# EAGLE design Hat_CoVASPSy_v1re2 (EAGLE 9.6.2)
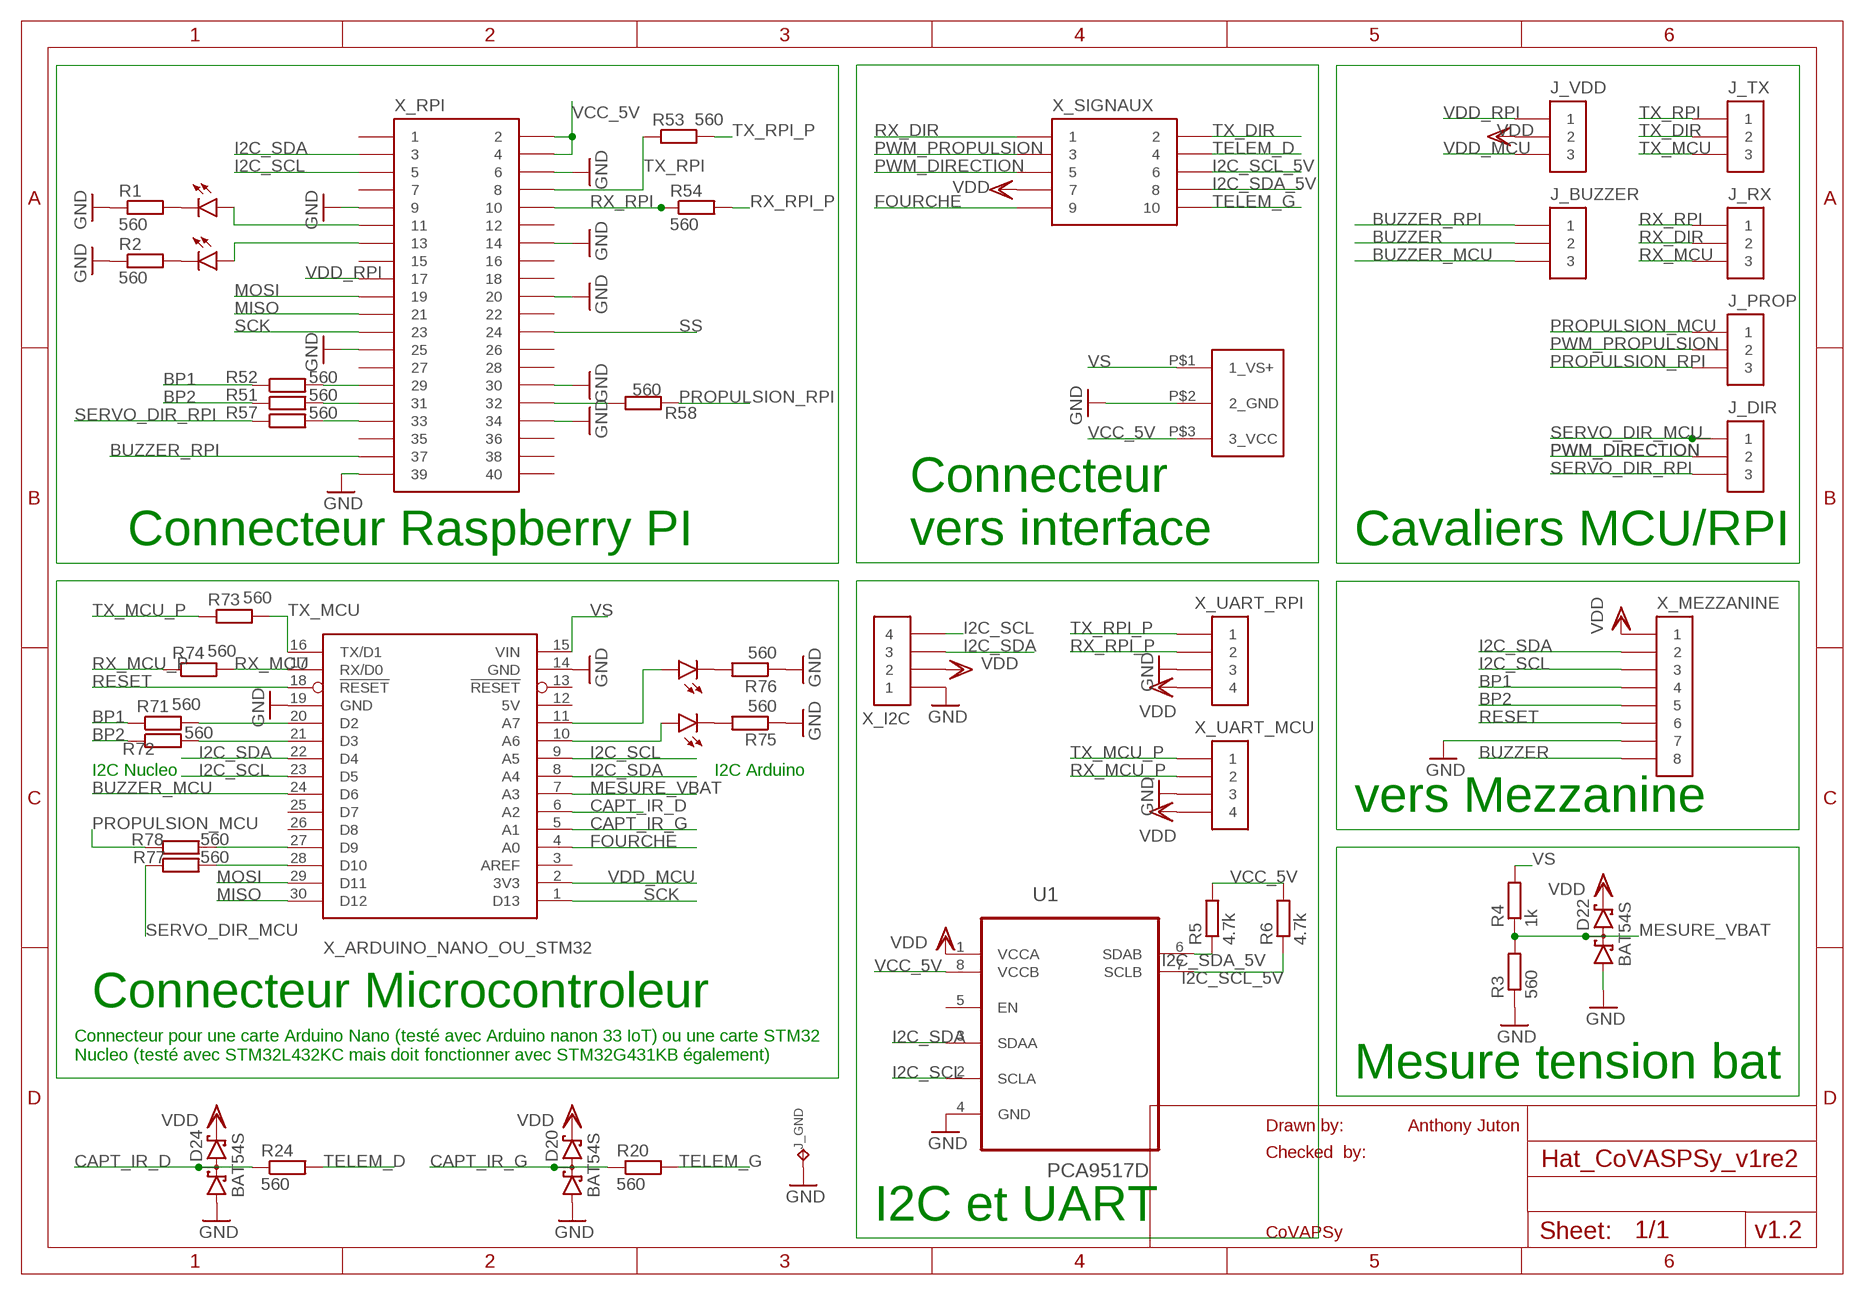
[diagram p0: schematic, sheet 1]

## Parts
D20  BAT54S  [SOT23]
D22  BAT54S  [SOT23]
D24  BAT54S  [SOT23]
J_BUZZER  CAVALIER_3  [CAVALIER_3]
J_DIR  CAVALIER_3  [CAVALIER_3]
J_GND  COSSE_POIGN  [COSSE_POIGNARD]
J_PROP  CAVALIER_3  [CAVALIER_3]
J_RX  CAVALIER_3  [CAVALIER_3]
J_TX  CAVALIER_3  [CAVALIER_3]
J_VDD  CAVALIER_3  [CAVALIER_3]
LED1  LEDSML1206  [SML1206]
LED2  LEDSML1206  [SML1206]
LED3  LEDSML1206  [SML1206]
LED4  LEDSML1206  [SML1206]
R1  560  R-EU_M1206  [M1206]
R2  560  R-EU_M1206  [M1206]
R3  560  R-EU_M1206  [M1206]
R4  1k  R-EU_M1206  [M1206]
R5  4.7k  R-EU_M1206  [M1206]
R6  4.7k  R-EU_M1206  [M1206]
R20  560  R-EU_M1206  [M1206]
R24  560  R-EU_M1206  [M1206]
R51  560  R-EU_M1206  [M1206]
R52  560  R-EU_M1206  [M1206]
R53  560  R-EU_M1206  [M1206]
R54  560  R-EU_M1206  [M1206]
R57  560  R-EU_M1206  [M1206]
R58  560  R-EU_M1206  [M1206]
R71  560  R-EU_M1206  [M1206]
R72  560  R-EU_M1206  [M1206]
R73  560  R-EU_M1206  [M1206]
R74  560  R-EU_M1206  [M1206]
R75  560  R-EU_M1206  [M1206]
R76  560  R-EU_M1206  [M1206]
R77  560  R-EU_M1206  [M1206]
R78  560  R-EU_M1206  [M1206]
U1  PCA9517D  [SOIC127P600X175-8N]
X_ALIM  CONN_ALIM_3TROUS  [CONN_ALIM_3TROUS]
X_ARDUINO_NANO_OU_STM32  ARDUINO_NANO_STM32_NUCLEO  [ARDUINO_NANO_STM32_NUCLEO]
X_I2C  MOLEX_4_DROIT  [MOLEX_4_DROIT]
X_MEZZANINE  MOLEX_8_DROIT  [MOLEX_8_DROIT]
X_RPI  HEADER_20X2  [HEADER_20X2]
X_SIGNAUX  HEADER_5X2  [HEADER_5X2]
X_UART_MCU  MOLEX_4_DROIT  [MOLEX_4_DROIT]
X_UART_RPI  MOLEX_4_DROIT  [MOLEX_4_DROIT]

## Nets
BP1: R52.1 R71.1 X_MEZZANINE.P$4
BP2: R51.1 R72.1 X_MEZZANINE.P$5
BUZZER: J_BUZZER.P$2 X_MEZZANINE.P$8
BUZZER_MCU: J_BUZZER.P$3 X_ARDUINO_NANO_OU_STM32.24(D6)
BUZZER_RPI: J_BUZZER.P$1 X_RPI.P$37
CAPT_IR_D: D24.3(C1A2) R24.1 X_ARDUINO_NANO_OU_STM32.6(A2)
CAPT_IR_G: D20.3(C1A2) R20.1 X_ARDUINO_NANO_OU_STM32.5(A1)
FOURCHE: X_ARDUINO_NANO_OU_STM32.4(A0) X_SIGNAUX.P$9
GND: D20.1(A1) D22.1(A1) D24.1(A1) J_GND.P$1 R1.1 R2.1 R3.1 R75.1 R76.1 U1.4(GND) X_ALIM.P$2(2_GND) X_ARDUINO_NANO_OU_STM32.14(GND) X_ARDUINO_NANO_OU_STM32.19(GND) X_I2C.P$1 X_MEZZANINE.P$7 X_RPI.P$6 X_RPI.P$9 X_RPI.P$14 X_RPI.P$20 X_RPI.P$25 X_RPI.P$30 X_RPI.P$34 X_RPI.P$39 X_UART_MCU.P$3 X_UART_RPI.P$3
I2C_SCL: U1.2(SCLA) X_ARDUINO_NANO_OU_STM32.9(A5) X_ARDUINO_NANO_OU_STM32.23(D5) X_I2C.P$4 X_MEZZANINE.P$3 X_RPI.P$5
I2C_SCL_5V: R6.1 U1.7(SCLB) X_SIGNAUX.P$6
I2C_SDA: U1.3(SDAA) X_ARDUINO_NANO_OU_STM32.8(A4) X_ARDUINO_NANO_OU_STM32.22(D4) X_I2C.P$3 X_MEZZANINE.P$2 X_RPI.P$3
I2C_SDA_5V: R5.1 U1.6(SDAB) X_SIGNAUX.P$8
MESURE_VBAT: D22.3(C1A2) R3.2 R4.1 X_ARDUINO_NANO_OU_STM32.7(A3)
MISO: X_ARDUINO_NANO_OU_STM32.30(D12) X_RPI.P$21
MOSI: X_ARDUINO_NANO_OU_STM32.29(D11) X_RPI.P$19
N$1: LED1.C R1.2
N$2: LED3.A X_ARDUINO_NANO_OU_STM32.11(A7)
N$3: R71.2 X_ARDUINO_NANO_OU_STM32.20(D2)
N$4: R72.2 X_ARDUINO_NANO_OU_STM32.21(D3)
N$5: LED2.C R2.2
N$6: LED1.A X_RPI.P$11
N$7: R52.2 X_RPI.P$29
N$9: R77.2 X_ARDUINO_NANO_OU_STM32.28(D10)
N$10: R51.2 X_RPI.P$31
N$15: LED3.C R76.2
N$17: LED2.A X_RPI.P$13
N$19: R57.2 X_RPI.P$33
N$20: R58.1 X_RPI.P$32
N$21: R78.2 X_ARDUINO_NANO_OU_STM32.27(D9)
N$22: LED4.A X_ARDUINO_NANO_OU_STM32.10(A6)
N$47: LED4.C R75.2
PROPULSION_MCU: J_PROP.P$1 R78.1
PROPULSION_RPI: J_PROP.P$3 R58.2
PWM_DIRECTION: J_DIR.P$2 X_SIGNAUX.P$5
PWM_PROPULSION: J_PROP.P$2 X_SIGNAUX.P$3
RESET: X_ARDUINO_NANO_OU_STM32.18(!RESET) X_MEZZANINE.P$6
RX_DIR: J_RX.P$2 X_SIGNAUX.P$1
RX_MCU: J_RX.P$3 R74.2 X_ARDUINO_NANO_OU_STM32.17(RX/D0)
RX_MCU_P: R74.1 X_UART_MCU.P$2
RX_RPI: J_RX.P$1 R54.1 X_RPI.P$10
RX_RPI_P: R54.2 X_UART_RPI.P$2
SCK: X_ARDUINO_NANO_OU_STM32.1(D13) X_RPI.P$23
SERVO_DIR_MCU: J_DIR.P$1 R77.1
SERVO_DIR_RPI: J_DIR.P$3 R57.1
SS: X_RPI.P$24
TELEM_D: R24.2 X_SIGNAUX.P$4
TELEM_G: R20.2 X_SIGNAUX.P$10
TX_DIR: J_TX.P$2 X_SIGNAUX.P$2
TX_MCU: J_TX.P$3 R73.2 X_ARDUINO_NANO_OU_STM32.16(TX/D1)
TX_MCU_P: R73.1 X_UART_MCU.P$1
TX_RPI: J_TX.P$1 R53.1 X_RPI.P$8
TX_RPI_P: R53.2 X_UART_RPI.P$1
VCC_5V: R5.2 R6.2 U1.8(VCCB) X_ALIM.P$3(3_VCC) X_RPI.P$2 X_RPI.P$4
VDD: D20.2(C2) D22.2(C2) D24.2(C2) J_VDD.P$2 U1.1(VCCA) X_I2C.P$2 X_MEZZANINE.P$1 X_SIGNAUX.P$7 X_UART_MCU.P$4 X_UART_RPI.P$4
VDD_MCU: J_VDD.P$3 X_ARDUINO_NANO_OU_STM32.2(3V3)
VDD_RPI: J_VDD.P$1 X_RPI.P$17
VS: R4.2 X_ALIM.P$1(1_VS+) X_ARDUINO_NANO_OU_STM32.15(VIN)
Unconnected: U1.5(EN) X_ARDUINO_NANO_OU_STM32.3(AREF) X_ARDUINO_NANO_OU_STM32.13(!RESET) X_ARDUINO_NANO_OU_STM32.25(D7) X_ARDUINO_NANO_OU_STM32.26(D8) X_RPI.P$1 X_RPI.P$7 X_RPI.P$12 X_RPI.P$15 X_RPI.P$16 X_RPI.P$18 X_RPI.P$22 X_RPI.P$26 X_RPI.P$27 X_RPI.P$28 X_RPI.P$35 X_RPI.P$36 X_RPI.P$38 X_RPI.P$40

## Notes on the sheet
- Connecteur Raspberry PI
- Connecteur
  vers interface
- Cavaliers MCU/RPI
- I2C Nucleo | I2C Arduino
- vers Mezzanine
- Connecteur Microcontroleur
- Connecteur pour une carte Arduino Nano (testé avec Arduino nanon 33 IoT) ou une carte STM32
  Nucleo (testé avec STM32L432KC mais doit fonctionner avec STM32G431KB également)
- Mesure tension bat
- Drawn by: | Anthony Juton
- Checked  by:
- I2C et UART
- CoVAPSy | v1.2

## Power pins joined to a net without a drawn wire
5V: X_ARDUINO_NANO_OU_STM32.12(5V)

## Library data of the parts
D20 D22 D24 = diode:BAT54S: Schottky Diodes Pin connection corrected 2011-05-04 Source: Fairchild .. BAT54.pdf
J_BUZZER J_DIR J_PROP J_RX J_TX J_VDD = lib_ens_aj_v1:CAVALIER_3
J_GND = lib_ens_aj_v1:COSSE_POIGN
LED1-LED4 = led:LED: LED OSRAM: - CHIPLED LG R971, LG N971, LY N971, LG Q971, LY Q971, LO R971, LY R971 LH N974, LH R974 LS Q976, LO Q976, LY Q976 LO Q996 - Hyper CHIPLED LW Q18S LB Q993, LB Q99A, LB R99A - SideLED LS A670, LO A670, LY A670, LG A670, LP A670 LB A673, LV A673, LT A673, LW A673 LH A674 LY A675 LS A676, LA A676, LO A676, LY A676, LW A676 LS A679, LY A679, LG A679 - Hyper Micro SIDELED® LS Y876, LA Y876, LO Y876, LY Y876 LT Y87S - SmartLED LW L88C, LW L88S LB L89C, LB L89S, LG L890 LS L89K, LO L89K, LY L89K LS L896, LA L896, LO L896, LY L896 - TOPLED LS T670, LO T670, LY T670, LG T670, LP T670 LSG T670, LSP T670, LSY T670, LOP T670, LYG T670 LG T671, LOG T671, LSG T671 LB T673, LV T673, LT T673, LW T673 LH T674 LS T676, LA T676, LO T676, LY T676, LB T676, LH T676, LSB T676, LW T676 LB T67C, LV T67C, LT T67C, LS T67K, LO T67K, LY T67K, LW E67C LS E67B, LA E67B, LO E67B, LY E67B, LB E67C, LV E67C, LT E67C LW T67C LS T679, LY T679, LG T679 LS T770, LO T770, LY T770, LG T770, LP T770 LB T773, LV T773, LT T773, LW T773 LH T774 LS E675, LA E675, LY E675, LS T675 LS T776, LA T776, LO T776, LY T776, LB T776 LHGB T686 LT T68C, LB T68C - Hyper Mini TOPLED® LB M676 - Mini TOPLED Santana® LG M470 LS M47K, LO M47K, LY M47K Source: http://www.osram.convergy.de LUXEON: - LUMILED® LXK2-PW12-R00, LXK2-PW12-S00, LXK2-PW14-U00, LXK2-PW14-V00 LXK2-PM12-R00, LXK2-PM12-S00, LXK2-PM14-U00 LXK2-PE12-Q00, LXK2-PE12-R00, LXK2-PE12-S00, LXK2-PE14-T00, LXK2-PE14-U00 LXK2-PB12-K00, LXK2-PB12-L00, LXK2-PB12-M00, LXK2-PB14-N00, LXK2-PB14-P00, LXK2-PB14-Q00 LXK2-PR12-L00, LXK2-PR12-M00, LXK2-PR14-Q00, LXK2-PR14-R00 LXK2-PD12-Q00, LXK2-PD12-R00, LXK2-PD12-S00 LXK2-PH12-R00, LXK2-PH12-S00 LXK2-PL12-P00, LXK2-PL12-Q00, LXK2-PL12-R00 Source: www.luxeon.com KINGBRIGHT: KA-3528ASYC Source: www.kingbright.com
R1-R6 R20 R24 R51-R54 R57 R58 R71-R78 = rcl:R-EU_: RESISTOR, European symbol
U1 = Texas Instruments_By_element14_Batch_1:PCA9517D: LEVEL-TRANSLATING I2C BUS REPEATER; MPN: PCA9517D; OC_FARNELL: 1831204; OC_NEWARK: 71M0457; PACKAGE: SOIC-8; SUPPLIER: Texas Instruments
X_ALIM = lib_ens_aj_v1:CONN_ALIM_3TROUS
X_ARDUINO_NANO_OU_STM32 = ArduinoNano_STM32_Nucleo:ARDUINO_NANO_STM32_NUCLEO: Arduino Nano V3.0 Overview: The Arduino Nano is a small, complete, and breadboard-friendly board based on the ATmega328 (Arduino Nano 3.x) or ATmega168 (Arduino Nano 2.x). It has more or less the same functionality of the Arduino Duemilanove, but in a different package. It lacks only a DC power jack, and works with a Mini-B USB cable instead of a standard one. The Nano was designed and is being produced by Gravitech. Specifications: Microcontroller Atmel ATmega168 or ATmega328 Operating Voltage (logic level) 5 V Input Voltage (recommended) 7-12 V Input Voltage (limits) 6-20 V Digital I/O Pins 14 (of which 6 provide PWM output) Analog Input Pins 8 DC Current per I/O Pin 40 mA Flash Memory 16 KB (ATmega168) or 32 KB (ATmega328) of which 2 KB used by bootloader SRAM 1 KB (ATmega168) or 2 KB (ATmega328) EEPROM 512 bytes (ATmega168) or 1 KB (ATmega328) Clock Speed 16 MHz Dimensions 0.73" x 1.70" Length 45 mm Width 18 mm Weigth 5 g Power: The Arduino Nano can be powered via the Mini-B USB connection, 6-20V unregulated external power supply (pin 30), or 5V regulated external power supply (pin 27). The power source is automatically selected to the highest voltage source. Memory: The ATmega168 has 16 KB of flash memory for storing code (of which 2 KB is used for the bootloader); the ATmega328 has 32 KB, (also with 2 KB used for the bootloader). The ATmega168 has 1 KB of SRAM and 512 bytes of EEPROM (which can be read and written with the EEPROM library); the ATmega328 has 2 KB of SRAM and 1 KB of EEPROM. Input and Output: Each of the 14 digital pins on the Nano can be used as an input or output, using pinMode(), digitalWrite(), and digitalRead() functions. They operate at 5 volts. Each pin can provide or receive a maximum of 40 mA and has an internal pull-up resistor (disconnected by default) of 20-50 kOhms. In addition, some pins have specialized functions. Visit Arduino - ArduinoBoardNano <https://www.arduino.cc/en/Main/ArduinoBoardNano>
X_I2C X_UART_MCU X_UART_RPI = lib_ens_aj_v1:MOLEX_4_DROIT
X_MEZZANINE = lib_ens_aj_v1:MOLEX_8_DROIT
X_RPI = lib_ens_aj_v1:HEADER_20X2
X_SIGNAUX = lib_ens_aj_v1:HEADER_5X2

## Net classes
0 default: width 0.4 mm, drill 0.6 mm, clearance 0.3 mm

## Board
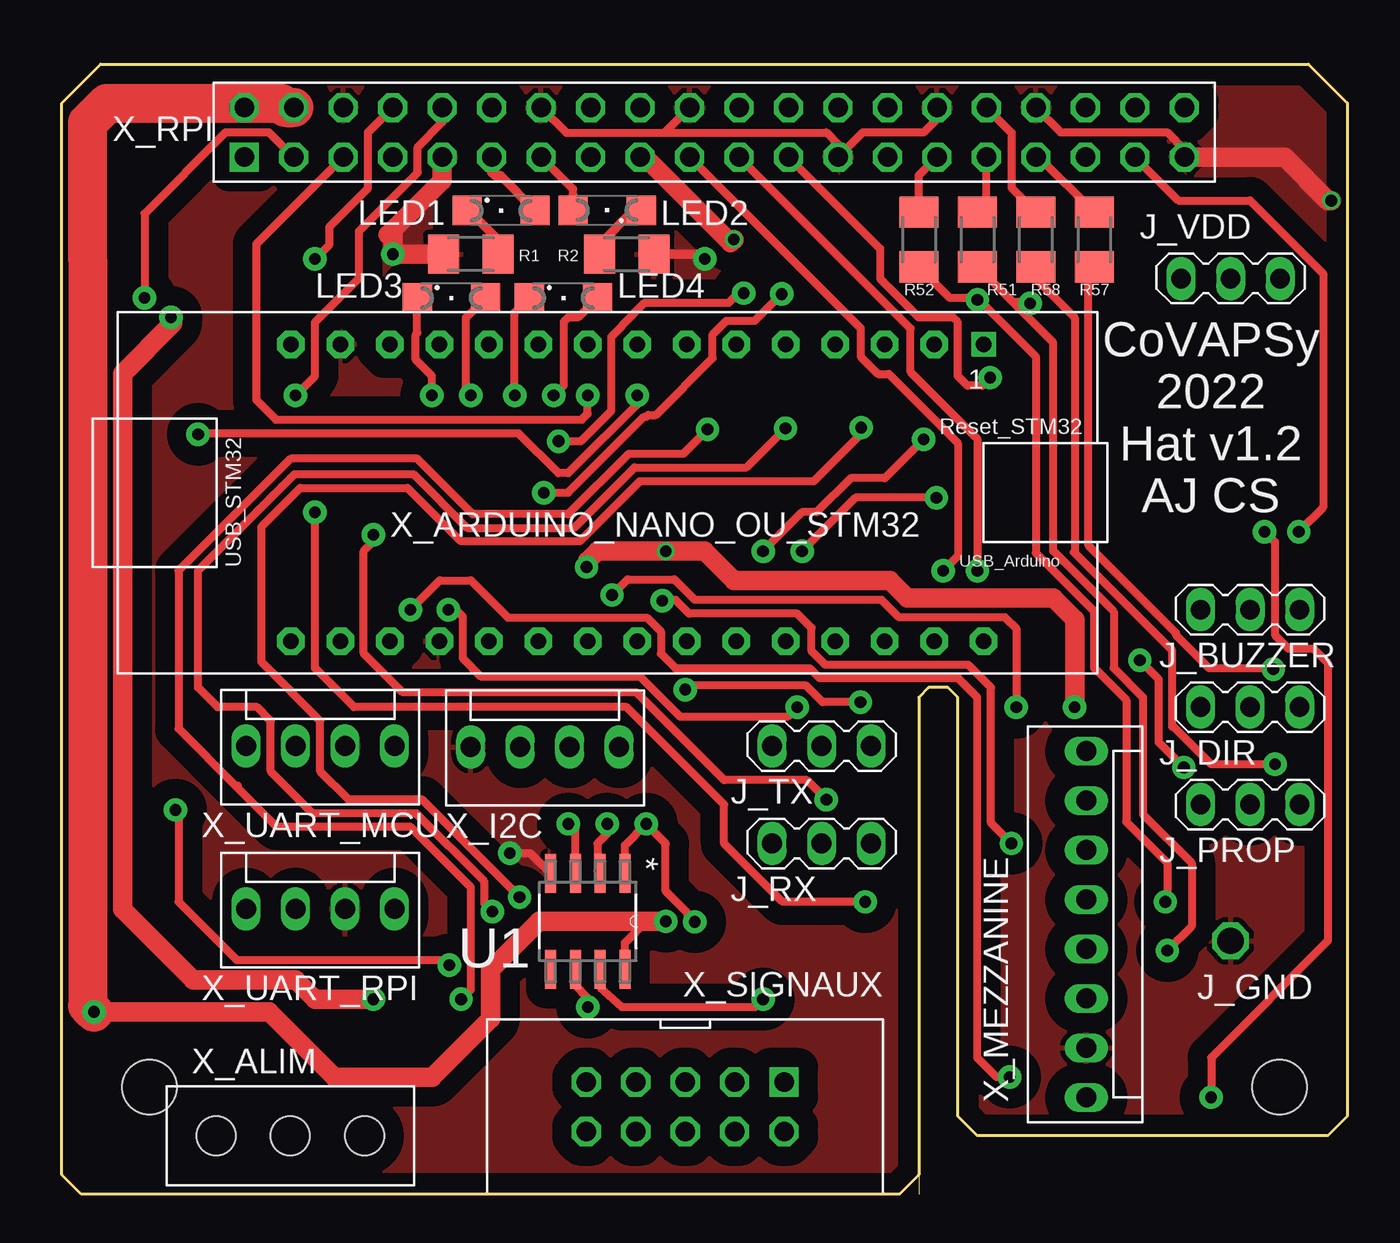
[diagram p1: board, top side]
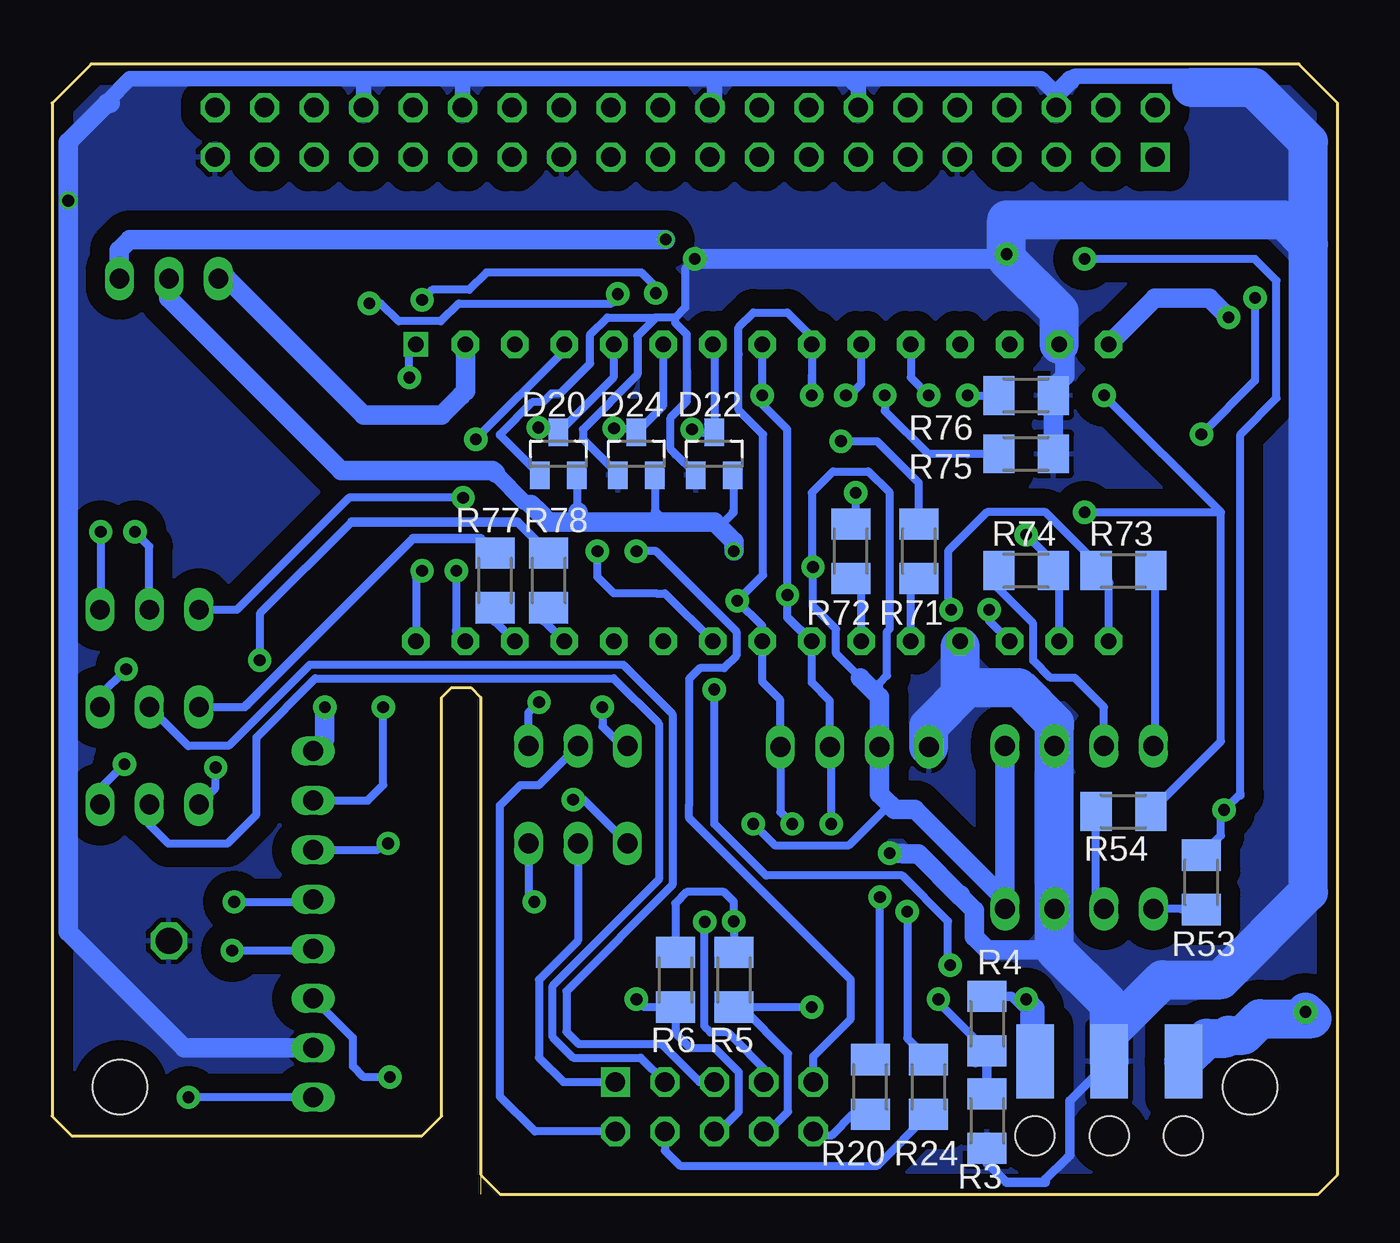
[diagram p2: board, bottom side, seen from below]

Size 66 x 58 mm. Coordinates in mm from the lower left corner, seen from the top.
Outline: 44,1 44,0
Outline: 44,1 44,25.5 44.5,26 45.5,26 46,25.5 46,4 47,3 65,3 66,4 66,56 64,58 2,58 0,56 0,1 1,0 43,0 44,1
Copper layers (1*16): Top 0.035mm / dielectric 1.5mm / Bottom 0.035mm
Design rules "ITEADstudio_DRC *": minimum track width 6mil, minimum drill 12mil, track to track 6mil, track to pad 6mil, pad to pad 6mil, via to via 6mil, smd to smd 0mil, copper to edge 5mil, drill to drill 10mil, minimum pad ring 6mil, minimum via ring 6mil, stop-mask expansion 2mil, vias tented up to drill 100mil, thermal gap 10mil
Holes 2.8 mm at 4.5,5.5 62.5,5.5

### Footprints (pad centres in the part's own frame; a part is rotated, then mirrored left to right if it is on the bottom)
SOT23 = smd 1 x 1.4: 1 -0.95,-1.1; 2 0.95,-1.1; 3 0,1.1
CAVALIER_3 = drill 1.016 pad 1.5 long: P$1 -2.54,0; P$2 0,0; P$3 2.54,0
COSSE_POIGNARD = drill 1.35 octagon: P$1 0,0
SML1206 = smd 1.5 x 1.5: A 1.75,0; C -1.75,0
M1206 = smd 1.6 x 2: 1 -1.4,0; 2 1.4,0
SOIC127P600X175-8N = smd 1.981 x 0.559: 1 -2.464,1.905; 2 -2.464,0.635; 3 -2.464,-0.635; 4 -2.464,-1.905; 5 2.464,-1.905; 6 2.464,-0.635; 7 2.464,0.635; 8 2.464,1.905
CONN_ALIM_3TROUS = smd 1.93 x 3.81 bottom: P$1 -2.54,-3.81; P$2 1.27,-3.81; P$3 5.08,-3.81 | hole 2: -2.54,0; 5.08,0; 1.27,0
ARDUINO_NANO_STM32_NUCLEO = drill 0.8 pad 1.27 square: 1 -20.32,-7.62 | drill 0.8 pad 1.422 octagon: 2 -17.78,-7.62; 3 -15.24,-7.62; 4 -12.7,-7.62; 5 -10.16,-7.62; 6 -7.62,-7.62; 7 -5.08,-7.62; 8 -2.54,-7.62; 9 0,-7.62; 10 2.54,-7.62; 11 5.08,-7.62; 12 7.62,-7.62; 13 10.16,-7.62; 14 12.7,-7.62; 15 15.24,-7.62; 16 15.24,7.62; 17 12.7,7.62; 18 10.16,7.62; 19 7.62,7.62; 20 5.08,7.62; 21 2.54,7.62; 22 0,7.62; 23 -2.54,7.62; 24 -5.08,7.62; 25 -7.62,7.62; 26 -10.16,7.62; 27 -12.7,7.62; 28 -15.24,7.62; 29 -17.78,7.62; 30 -20.32,7.62
MOLEX_4_DROIT = drill 1.016 pad 1.5 long: P$1 -2.54,0; P$2 0,0; P$3 2.54,0; P$4 5.08,0
MOLEX_8_DROIT = drill 1.016 pad 1.5 long: P$1 -2.54,0; P$2 0,0; P$3 2.54,0; P$4 5.08,0; P$5 7.62,0; P$6 10.16,0; P$7 12.7,0; P$8 15.24,0
HEADER_20X2 = drill 1 pad 1.5 square: P$1 -24.13,-1.27 | drill 1 pad 1.5 octagon: P$2 -24.13,1.27; P$3 -21.59,-1.27; P$4 -21.59,1.27; P$5 -19.05,-1.27; P$6 -19.05,1.27; P$7 -16.51,-1.27; P$8 -16.51,1.27; P$9 -13.97,-1.27; P$10 -13.97,1.27; P$11 -11.43,-1.27; P$12 -11.43,1.27; P$13 -8.89,-1.27; P$14 -8.89,1.27; P$15 -6.35,-1.27; P$16 -6.35,1.27; P$17 -3.81,-1.27; P$18 -3.81,1.27; P$19 -1.27,-1.27; P$20 -1.27,1.27; P$21 1.27,-1.27; P$22 1.27,1.27; P$23 3.81,-1.27; P$24 3.81,1.27; P$25 6.35,-1.27; P$26 6.35,1.27; P$27 8.89,-1.27; P$28 8.89,1.27; P$29 11.43,-1.27; P$30 11.43,1.27; P$31 13.97,-1.27; P$32 13.97,1.27; P$33 16.51,-1.27; P$34 16.51,1.27; P$35 19.05,-1.27; P$36 19.05,1.27; P$37 21.59,-1.27; P$38 21.59,1.27; P$39 24.13,-1.27; P$40 24.13,1.27
HEADER_5X2 = drill 1 pad 1.5 square: P$1 -5.08,0 | drill 1 pad 1.5 octagon: P$2 -5.08,2.54; P$3 -2.54,0; P$4 -2.54,2.54; P$5 0,0; P$6 0,2.54; P$7 2.54,0; P$8 2.54,2.54; P$9 5.08,0; P$10 5.08,2.54

### Placement (x,y rotation side)
D20  40,38 0 bottom
D22  32,38 0 bottom
D24  36,38 0 bottom
J_BUZZER  61,30 180 top
J_DIR  61,25 0 top
J_GND  60,13 0 top
J_PROP  61,20 0 top
J_RX  39,18 180 top
J_TX  39,23 180 top
J_VDD  60,47 180 top
LED1  22.55,50.49 0 top
LED2  28,50.5 180 top
LED3  20,46 0 top
LED4  25.75,46 0 top
R1  21,48.25 0 top
R2  29,48.25 180 top
R3  18,3.75 90 bottom
R4  18,8.75 90 bottom
R5  31,11 90 bottom
R6  34,11 90 bottom
R20  24,5.5 270 bottom
R24  21,5.5 270 bottom
R51  47,49 90 top
R52  44,49 90 top
R53  7,16 270 bottom
R54  11,19.64 180 bottom
R57  53,49 90 top
R58  50,49 270 top
R71  21.5,33 270 bottom
R72  25,33 270 bottom
R73  11,32 180 bottom
R74  16,32 0 bottom
R75  16,38 180 bottom
R76  16,41 180 bottom
R77  43.25,31.5 270 bottom
R78  40.5,31.5 270 bottom
U1  27,14 270 top
X_ALIM  13,3 180 top
X_ARDUINO_NANO_OU_STM32  27,36 180 top
X_I2C  23.53,22.96 0 top
X_MEZZANINE  52.6,20.2 270 top
X_RPI  33.5,54.5 0 top
X_SIGNAUX  32,5.75 180 top
X_UART_MCU  12,23 0 top
X_UART_RPI  12,14.63 0 top

### Tracks (layer width: path | path; a pad name or v marks a point on that pad's centre or on a via)
BP1  (via drill 0.6 pad 1.2)
  Top 0.4: R52.1 45.6,46 46.9,46 | 46.9,46 47,46 50,43 50,32.91 53,29.91 53,27 54.64,25.36 54.64,19.11 56.75,17 56.75,15 v56.65,15 | v25.5,38.65 26.65,38.65 28.21,40.21 28.21,44 28.75,44.54 28.75,44.58 29.92,45.75 34.25,45.75 34.88,46.38 v35,46.25 | v47,45.9 46.9,46
  Bottom 0.4: 21.1,34.4 R71.1 21.5,36.5 23.65,38.65 v25.5,38.65 | v35,46.25 34.85,46.4 35.75,47.3 43.7,47.3 44.58,46.42 46.48,46.42 v47,45.9 | v56.65,15 52.73,15 X_MEZZANINE.P$4
BP2  (via drill 0.6 pad 1.2)
  Top 0.4: R51.1 48.8,45.8 | 48.8,45.8 50.9,43.7 50.9,33 54,29.9 54,27 55.5,25.5 55.5,19.5 58,17 58,13.75 v56.75,12.5 | 48.8,45.8 49.63,45.8 v49.72,45.72 | v24.75,36 26,36 29.9,39.9 30,39.9 30.1,40 30.5,40 33.41,42.91 33.41,44.12 34.12,44.83 35.58,44.83 v36.95,46.2
  Bottom 0.4: v36.95,46.2 36.95,46.05 37.28,45.72 45.13,45.72 46.04,44.8 48.21,44.8 49.12,45.72 v49.72,45.72 | R72.1 24.75,34.65 v24.75,36 | v56.75,12.5 52.69,12.5 X_MEZZANINE.P$5
BUZZER  (via drill 0.6 pad 1.2)
  Top 0.4: v61.75,34 62.27,33.48 62.27,28.7 62.97,28 64.25,28 65,27.25 65,13 59,7 v59,4.96
  Bottom 0.4: X_MEZZANINE.P$8 v59,4.96 | J_BUZZER.P$2 61,33.25 v61.75,34
BUZZER_MCU  (via drill 0.6 pad 1.2)
  Top 0.4: v44.9,35.75 40.75,35.75 v38,33
  Bottom 0.4: v38,33 38,31.68 37.16,30.84 35,30.84 34.54,30.84 X_ARDUINO_NANO_OU_STM32.24 | v44.9,35.75 50.75,35.75 56.5,30 J_BUZZER.P$3
BUZZER_RPI  (via drill 0.6 pad 1.2)
  Top 0.4: v63.5,34 64.75,35.25 64.75,47.25 61,51 57.32,51 X_RPI.P$37
  Bottom 0.4: J_BUZZER.P$1 63.5,30.04 v63.5,34
CAPT_IR_D  (via drill 0.6 pad 1.2)
  Top 0.4: v37.15,39.3 35.15,37.3 29.39,37.3 26.29,34.2 20.81,34.2 18.06,36.95 11.95,36.95 7,32 7,26 8,25 10.03,25 10.73,24.3 10.73,21.7 12.88,19.55 18.19,19.55 21.7,16.04 21.7,14.9 v22.1,14.5 21.75,14.86
  Bottom 0.4: R24.1 22.1,8 v22.1,14.5 22,14.5 | v37.15,39.3 36.2,39.3 D24.3 34.62,40.48 X_ARDUINO_NANO_OU_STM32.6
CAPT_IR_G  (via drill 0.6 pad 1.2)
  Top 0.4: v41.04,39.35 41,39.31 41,39 38.6,36.6 29.68,36.6 26.58,33.5 20.5,33.5 17.75,36.25 12.24,36.25 10.25,34.26 10.25,27.32 13.27,24.3 13.27,21.7 14.72,20.25 18.5,20.25 v23.5,15.25
  Bottom 0.4: R20.1 23.5,7.4 v23.5,15.25 | v41.04,39.35 40.25,39.35 D20.3 37.16,41.94 X_ARDUINO_NANO_OU_STM32.5
FOURCHE  (via drill 0.6 pad 1.2)
  Top 0.4: v44.25,38.75 42.25,36.75 40.5,36.75 38.75,35 38,35 v36,33
  Bottom 0.4: v44.25,38.75 39.7,43.3 X_ARDUINO_NANO_OU_STM32.4 | v36,33 34.99,33 30.87,28.88 30.87,27.63 31.5,27 32.75,27 33.3,26.45 33.3,20 33.3,19.3 25,11 25,9 26.92,7.08 X_SIGNAUX.P$9
GND  (via drill 0.6, 0.6 pad 1.2)
  Top 0.4: X_RPI.P$20 30.94,54.48 | X_RPI.P$14 25.9,54.48 30.94,54.48 | 30.94,54.48 39.23,54.48 39.25,54.5 39.85,53.9 X_RPI.P$25 41.12,54.5 44.25,54.5 44.93,55.18 X_RPI.P$30 | X_RPI.P$34 51.28,54.5 56.75,54.5 57.63,53.62 X_RPI.P$39 | U1.4 24.06,17.5 v23,17.5
  Top 0.5: 30.8,47.85 R2.1 | R2.1 30.4,48.69 | R2.1 32.75,48.25 v33,48
  Top 1: X_RPI.P$9 19.53,52.02 16.76,49.25 17,49.25 v17,48.25 R1.1 | X_RPI.P$39 62.77,53.23 65,51 v65.17,51
  Bottom 0.4: 34,45 35,45 | 33,36.95 D22.1 32.95,36.95 34,38 | 34,37.95 34,38 | D20.1 43,38.95 43,39 41.35,40.65 40.79,40.65 40.33,41.11 39.9,41.11 38.37,42.64 38.37,44.12 37.49,45 35,45 | 34,45 33.5,45.5 33.5,47.5 v33,48 | 34,38 34.25,38.25 34.25,39.86 33.41,40.7 33.41,44.12 34,44.71 34,45 | D24.1 36.95,36.95 38.75,38.75 38.75,39.26 35.95,42.06 35.95,44.05 35,45 | 58.51,7.5 56,7.5 | 13.75,2 13.88,1.88 | X_RPI.P$34
  Bottom 0.5: X_ALIM.P$2 13.75,4.79 13.75,2 | R3.1 18,1.6 17,0.6 15,0.6 15,0.75 13.88,1.88
  Bottom 0.8: X_RPI.P$34 50,57.18 | 45,57.18 44.93,57.11 X_RPI.P$30 | 25,57.18 24.61,56.79 | X_RPI.P$6 14.45,56.45 15.25,57.25 25,57.25 | 25,57.25 62,57.25 63.17,56.08 63.17,56 | X_RPI.P$20 32,56 32,57.18 | X_RPI.P$14 24.61,56.86 25,57.25 | 13.72,57.18 13.5,57.4 5,57.4
  Bottom 1: R75.1 R76.1 14.6,41.4 14,42 14,43.32 X_ARDUINO_NANO_OU_STM32.14 14.3,44.3 | X_ARDUINO_NANO_OU_STM32.19 19.38,28.1 | 19.36,15.36 19.36,15.28 | 15,14 14.54,14.46 X_UART_RPI.P$3 X_UART_MCU.P$3 14.54,24 14.54,24.54 16,26 19,26 19.38,26 19.38,25.38 20.99,23.77 X_I2C.P$1 | 63,56 63.17,56 65.17,54 v65.17,51 65.17,13.47 59.21,7.5 56,7.5 X_MEZZANINE.P$7 | 14.45,56.45 13.72,57.18 | 19.36,15.28 21.53,17.45 22.29,17.45 22.34,17.5 v23,17.5 | 19.36,15.28 18.65,14.57 18.65,13.21 17.98,12.54 14.54,12.54
  Bottom 1.016: 17,48 v33,48
  Bottom 2: 1.5,48.75 2.75,50 17,50 v17,48.25 17,48 14.3,45.3 X_ARDUINO_NANO_OU_STM32.14 | 1.5,48.75 1.5,15.5 6,11 9,11 11.73,8.27 X_ALIM.P$2 11.73,9.73 14.54,12.54 14.54,24 14.54,24.17 16.37,26 19.38,26 19.38,28.1 | X_I2C.P$1 20.99,24.01 19,26 | 1.5,48.75 1.5,54 4.3,56.8 7.5,56.8
  pour Bottom (isolate 1): 0,58 66,58 66,3 46,3 46,26 44,26 44,0 0,0
  pour Top (isolate 1): 0,0 0,58 66,58 66,3 46,3 46,26 44,26 44,0
I2C_SCL  (via drill 0.6 pad 1.2)
  Top 0.4: v27,41 27,40.06 26.69,39.75 11,39.75 10,40.75 10,48.78 X_RPI.P$5 | v30.83,30.45 30.88,30.5 31.51,30.5 32.21,29.8 37.75,29.8 38.49,29.06 38.49,27.88 39.2,27.17 46.53,27.17 47.7,26 47.7,19.05 v48.75,18 | v28,19 28,18.5 27.5,18 27.5,16.6 U1.2
  Bottom 0.4: v28,19 28.61,19.61 X_I2C.P$4 28.61,25.36 29.54,26.29 X_ARDUINO_NANO_OU_STM32.23 29.54,29.16 v30.83,30.45 29.5,31.78 29.5,39 30.75,40.25 30.75,43.12 30.75,44.5 30,45.25 28.25,45.25 27,44 X_ARDUINO_NANO_OU_STM32.9 v27,41 27,42 | X_MEZZANINE.P$3 49.34,17.66 v48.75,18
I2C_SCL_5V  (via drill 0.6 pad 1.2)
  Top 0.4: U1.7 27.64,10.62 28.75,9.6 35.6,9.6 v36,10
  Bottom 0.4: 33.85,9.6 R6.1 | X_SIGNAUX.P$6 31.77,3.21 30.75,4.23 30.75,6.27 31.98,7.5 33.25,7.5 34,8.25 R6.1 | v36,10 35.6,9.6 R6.1
I2C_SDA  (via drill 0.6 pad 1.2)
  Top 0.4: v29.54,41 29.77,40.77 26,37 25.5,37 23.45,39.05 7.05,39.05 v7,39 | v28.25,30.75 29.05,31.55 31.45,31.55 32.5,30.5 42.09,30.5 42.99,29.6 48.42,29.6 49.02,29 49.02,25.02 v49,25 | v4.25,46 4,46 4.25,46.25 4.25,50.34 8.4,54.49 10.65,54.49 X_RPI.P$3 | U1.3 26.36,18.64 v26,19
  Bottom 0.4: X_I2C.P$3 26.32,22.96 | 28.25,29.63 28.25,29.57 27.06,28.38 27.25,28.19 | 28.25,29.63 v28.25,30.75 28.25,39.25 29.54,40.54 v29.54,41 X_ARDUINO_NANO_OU_STM32.8 | v4.25,46 4.25,41.75 v7,39 | v26,19 26,22.89 X_I2C.P$3 | X_MEZZANINE.P$2 49.8,20.2 49,21 v49,25 | 28.25,29.63 X_ARDUINO_NANO_OU_STM32.22 27,26.25 26.07,25.32 X_I2C.P$3
I2C_SDA_5V  (via drill 0.6 pad 1.2)
  Top 0.4: U1.6 26.36,10.71 27,10.08 v27,9.6
  Bottom 0.4: 31.02,9.62 R5.1 | R5.1 30.6,9.6 28.21,7.21 28.21,4.23 29.23,3.21 X_SIGNAUX.P$8 | 27.25,9.35 v27,9.6 R5.1
MESURE_VBAT  (via drill 0.6 pad 1.2)
  Top 0.4: v20.5,10 21,10.5 21,15.75 17.9,18.85 11.04,18.85 8.93,20.96 | v33.15,39.25 31.9,38 29.1,38 26,34.9 21.1,34.9 18.25,37.75 11.75,37.75 6,32 6,23.89 8.93,20.96 | 8.93,20.96 9.04,20.96
  Bottom 0.4: v20.5,10 20.57,9.93 R4.1 | v33.15,39.25 33.15,39.1 D22.3 32,43.54 X_ARDUINO_NANO_OU_STM32.7
  Bottom 0.5: R3.2 R4.1 18.6,6.75
MISO  (via drill 0.6 pad 1.2)
  Top 0.4: v47,32 47,38.77 43.57,42.2 43.57,44.43 X_RPI.P$21
  Bottom 0.4: v47,32 47.32,31.68 X_ARDUINO_NANO_OU_STM32.30
MOSI  (via drill 0.6 pad 1.2)
  Top 0.4: v45.25,32 46,32.75 46,38.56 42.46,42.1 41.9,42.1 41,43 41,44.46 X_RPI.P$19
  Bottom 0.4: v45.25,32 45.25,29 45.25,28.85 X_ARDUINO_NANO_OU_STM32.29
N$1
  Top 0.5: LED1.C 20.91,50.49 22.4,49 R1.2
N$2  (via drill 0.6 pad 1.2)
  Top 0.4: 21.92,45.83 LED3.A 20.75,45 20.75,41.25 v21,41
  Bottom 0.4: X_ARDUINO_NANO_OU_STM32.11 21.92,41.92 v21,41
N$3
  Bottom 0.4: X_ARDUINO_NANO_OU_STM32.20 21.92,31.18 21.68,31.43
  Bottom 0.5: 21.92,31.18 21.68,31.43 R71.2
N$4
  Bottom 0.4: R72.2 25,31.54 24.46,31 X_ARDUINO_NANO_OU_STM32.21
N$5
  Top 0.5: LED2.C 29.35,50.5 27.6,48.75 R2.2
N$6
  Top 0.4: 22.07,52.47 X_RPI.P$11
  Top 0.5: LED1.A 22.52,52.27 22.27,52.27 22.07,52.47
N$7
  Top 0.4: R52.2 44,52 44,52.3 X_RPI.P$29
N$9
  Bottom 0.4: X_ARDUINO_NANO_OU_STM32.28 43.25,29.39
  Bottom 0.5: 43.25,29.39 43.25,30 R77.2
N$10
  Top 0.4: R51.2 47.47,50.87 X_RPI.P$31
N$15  (via drill 0.6 pad 1.2)
  Top 0.4: LED3.C 18.25,44.2 18.17,44.12 18.17,42.83 19,42 v19,41
  Bottom 0.4: v19,41 R76.2
N$17
  Top 0.4: 26.25,51.25 26.25,51.59 X_RPI.P$13
  Top 0.5: LED2.A 26.25,51.25
N$19
  Top 0.4: X_RPI.P$33 50.17,53.23 R57.2
N$20
  Top 0.4: X_RPI.P$32 48.75,54.49 48.75,51.65 R58.1
N$21
  Bottom 0.4: X_ARDUINO_NANO_OU_STM32.27 40.75,29.43
  Bottom 0.5: R78.2 40.65,30.1 40.75,30 40.75,29.43
N$22  (via drill 0.6 pad 1.2)
  Top 0.4: LED4.A 26.5,45 26,45 25.77,44.77 25.77,41.52 v25.25,41
  Bottom 0.4: v25.25,41 25.06,41 24.46,41.6 X_ARDUINO_NANO_OU_STM32.10
N$47  (via drill 0.6 pad 1.2)
  Top 0.4: LED4.C 23.23,45.23 23.23,41.02 v23.25,41
  Bottom 0.4: v23.25,41 23.25,40.21 21.02,37.98 | 19,37.98 21.02,37.98 | 18.98,38 R75.2 21,38 21.02,37.98
PROPULSION_MCU  (via drill 0.6 pad 1.2)
  Top 0.4: v55.34,27.4 56.3,26.44 56.3,23.2 v57.6,21.9
  Bottom 0.4: 50.63,34.5 55.34,29.79 v55.34,27.4 | J_PROP.P$1 57.6,20.86 v57.6,21.9
  Bottom 0.5: R78.1 42.1,34.5 50.63,34.5
PROPULSION_RPI  (via drill 0.6 pad 1.2)
  Top 0.4: R58.2 50,46.99 52,44.99 52,33 51.95,32.95 57,27.9 57,24 57.06,24 59,22.06 v62.28,22.06
  Bottom 0.4: J_PROP.P$3 63.54,20.8 v62.28,22.06
PWM_DIRECTION
  Bottom 0.4: J_DIR.P$2 59,23 56.94,23 52.77,27.17 36.67,27.17 34.15,24.65 34.15,15.86 39.6,10.41 39.6,8.34 38.96,7.7 34.72,7.7 32.77,5.75 X_SIGNAUX.P$5
PWM_PROPULSION
  Bottom 0.4: J_PROP.P$2 61,18.97 60.01,17.99 57.01,17.99 55.5,19.5 55.5,23.45 52.48,26.47 37.17,26.47 34.85,24.15 34.85,16.15 40.3,10.7 40.3,8.05 39.25,7 35.79,7 X_SIGNAUX.P$3
RESET  (via drill 0.6 pad 1.2)
  Top 0.4: v48.65,6 48,6 47,7 47,25.5 46.03,26.47 38.91,26.47 38.38,27 31.5,27 30.75,27.75 30.75,28.88 30.04,29.59 22.91,29.59 21,31.5 19.4,31.5 v17.9,30 18,30
  Bottom 0.4: X_ARDUINO_NANO_OU_STM32.18 17.9,29.44 v17.9,30 | v48.65,6 50,6 50.55,6.55 50.55,8 | 50.55,8 50.55,8.04 | 50.55,8 X_MEZZANINE.P$6
RX_DIR
  Bottom 0.4: J_RX.P$2 39,13 41,11 41,7 39.75,5.75 X_SIGNAUX.P$1
RX_MCU  (via drill 0.6 pad 1.2)
  Top 0.4: v39.25,20.25 38.25,21.25 34,21.25 29.5,25.75 17.5,25.75 15.5,27.75 15.5,33 16.18,33.67 v16,33.85
  Bottom 0.4: v39.25,20.25 38.71,20.25 J_RX.P$3 | X_ARDUINO_NANO_OU_STM32.17 14.3,31.7 R74.2 14.6,32.45 v16,33.85
RX_MCU_P
  Bottom 0.4: X_UART_MCU.P$2 12,25 13.5,26.5 14.75,26.5 15.63,27.38 15.63,29.28 17.4,31.06 R74.1
RX_RPI  (via drill 0.6 pad 1.2)
  Top 0.4: v12,41 13,42 13,44.75 15.25,47 15.25,49.42 18.27,52.44 18.27,53.75 19.53,55.02 X_RPI.P$10 | v41.25,15 37,15 34,18 34,20 29,25 15,25 13,27 13,34.5 12.75,34.75 v13,35
  Bottom 0.4: R54.1 6,23.23 6,35 | v12,41 6,35 | J_RX.P$1 41.54,15 v41.25,15 | v13,35 6,35
RX_RPI_P
  Bottom 0.4: R54.2 12.41,19.62 12.41,15.05 X_UART_RPI.P$2
SCK  (via drill 0.6 pad 1.2)
  Top 0.4: 47.38,41.62 v47.66,41.91 47.25,41.5 46.5,41.5 46,42 46,44.75 45.75,45 44,45 42,47 42,48.54 X_RPI.P$23
  Bottom 0.4: v47.66,41.91 47.66,43.28 X_ARDUINO_NANO_OU_STM32.1
SERVO_DIR_MCU
  Bottom 0.4: J_DIR.P$1 56.1,25 56,25.11
  Bottom 0.5: R77.1 44,33.65 47.45,33.65 56,25.11
SERVO_DIR_RPI  (via drill 0.6 pad 1.2)
  Top 0.4: 52.37,46.97 R57.1 52.7,47.3 52.7,33.3 57.19,28.81 57.19,28.7 58.89,27 62.13,27 v62.19,26.94
  Bottom 0.4: v62.19,26.94 63.54,25.59 J_DIR.P$3
TELEM_D
  Bottom 0.4: X_SIGNAUX.P$4 34.54,2.23 33.77,1.46 23.64,1.46 R24.2
TELEM_G
  Bottom 0.4: R20.2 24.9,4.1 26,3 26.71,3 X_SIGNAUX.P$10
TX_DIR
  Bottom 0.4: X_SIGNAUX.P$2 41.21,3.21 43,5 43,19.96 41.96,21 41,21 J_TX.P$2
TX_MCU  (via drill 0.6 pad 1.2)
  Top 0.4: v37.75,25 37.25,24.5 31.75,24.5 29.7,26.55 21.54,26.55 20.59,27.5 20.59,29.63 20.22,30 v19.85,30
  Bottom 0.4: v37.75,25 37.75,24 36.75,23 J_TX.P$3 | v19.85,30 20,30.15 20,33 18,35 15,35 12.4,32.4 R73.2 | R73.2 12.4,32.35 12,32.75 | R73.2 12.4,32.6 | R73.2 11.9,32.5 | X_ARDUINO_NANO_OU_STM32.16 11.76,31.36
  Bottom 0.5: 11.76,31.36 R73.2
TX_MCU_P
  Bottom 0.4: R73.1 9.39,31.79 9.39,23.07 X_UART_MCU.P$1
TX_RPI  (via drill 0.6 pad 1.2)
  Top 0.4: v13,48 13.75,48.75 13.75,49.66 15.71,51.62 15.71,54.49 X_RPI.P$8 | 20,11.75 v19.9,11.75 19.65,12 9,12 6,15 6,19.55 v5.83,19.72 | v41,25.25 39.06,25.25 38.21,26.1 32.2,26.1 v32,25.9
  Bottom 0.4: v13,48 4.25,48 3.15,46.9 3.15,40.85 5,39 5,20.55 | 5,20.44 5,20.55 | R53.1 6,18.4 6,20 5.83,19.83 v5.83,19.72 5,20.55 | v19.9,11.75 20,11.85 20,14 22.35,16.35 29.35,16.35 32,19 v32,25.9 | J_TX.P$1 41.54,24.71 v41,25.25
TX_RPI_P
  Bottom 0.4: X_UART_RPI.P$1 8.04,14.63 8,14.6 R53.2
VCC_5V  (via drill 0.6 pad 1.2)
  Top 0.4: U1.8 28.91,12.9 30,14 v31,14 | 9,55.77 8.23,55.77
  Top 1: 1,13 1,48 1.33,48 | 9.14,56 8,56 8.23,55.77 X_RPI.P$2 | v1.65,9.35 10.65,9.35 14,6 19,6 22,9 22,11.5 24.5,14 v31,14 | 10.23,55.77 9,55.77 | X_RPI.P$4 11,55.77 | 10.23,55.77 11,55.77 | 10.23,55.77 10,56 10.77,56 11,55.77
  Top 2: v1.65,9.35 1.33,9.67 1.33,48 1.33,55 2.32,55.99 11.27,55.99 11.49,55.77 X_RPI.P$4
  Bottom 0.4: 33.6,12.4 R6.2 34,14.92 33.42,15.5 31.5,15.5 31,15 v31,14 R5.2
  Bottom 2: X_ALIM.P$3 6.73,8 5.75,8 5.6,8.15 4.85,8.15 4,9 1.33,9 1.33,9.03 v1.65,9.35
VDD  (via drill 0.6, 0.6 pad 1.2)
  Top 0.4: U1.1 28.91,17.91 v30,19 31,18 31,15.56 32.1,14.46 32.1,14.37 v32.5,13.97
  Top 1: v52,25 52,29.5 50.9,30.6 43.4,30.6 42.5,31.5 34.5,31.5 33,33 v31,33 27.49,33 27,32.51 27,32.25 v26.94,32.19
  Bottom 0.4: 31.05,35.05 31,35 | 31,35 31.5,34.5 32,34.5 34.5,34.5 35.05,35.05 | 35.05,35.05 35.05,34.95 35.37,34.63 38.63,34.63 39,35 39.05,35.05 D20.2 | 31,35 31,36.85 D22.2 | D24.2 35.05,35.05 | 23,20 25.1,17.9 28.9,17.9 v30,19 | 24.5,26.5 25.75,27.75 25.75,29 26.94,30.19 v26.94,32.19 27,32.25 27,36 25.9,37.1 24.1,37.1 23,36 23,29.01 23.13,28.88 23.13,26.62 23.53,26.22 23.53,25 | X_SIGNAUX.P$7 29.11,6.1 31.31,8.3 32.21,8.3 32.5,8.59 32.5,13.91 | 32.5,13.91 32.45,13.96 | 32.5,13.91 v32.5,13.97
  Bottom 0.8: 41,35 41.5,35.5 41.74,35.5 43.24,37
  Bottom 1: X_UART_MCU.P$4 X_UART_RPI.P$4 17.08,15.13 21.7,19.75 22.75,19.75 23,20 23.53,20.53 X_I2C.P$2 23.53,25 23.53,25.53 24.5,26.5 | v31,33 31,33.5 32,34.5 39,34.5 | 39,34.5 39,35 | 39,34.5 40.5,34.5 41,35 41.4,35.4 | 43.24,37 43.39,37.15 51.15,37.15 60,46 J_VDD.P$2 | X_MEZZANINE.P$1 52,23.34 v52,25
VDD_MCU
  Bottom 1: J_VDD.P$3 57,47 50,40 46,40 45,41 44.78,41.22 X_ARDUINO_NANO_OU_STM32.2
VDD_RPI  (via drill 0.6)
  Top 1: X_RPI.P$17 29.94,53.23 34.34,48.84 v34.5,49
  Bottom 1: v34.5,49 62,49 62.54,48.46 J_VDD.P$1
VS  (via drill 0.6 pad 1.2)
  Top 1: v5.6,45 5.7,45 5.7,44.7 3.13,42.13 3.13,14.62 6.75,11 12,11 13,10 v16,10
  Bottom 0.5: R4.2 16.75,10.15 15.8,9.2 15.54,8.94
  Bottom 1: v5.6,45 6.6,46 9.38,46 X_ARDUINO_NANO_OU_STM32.15 | X_ALIM.P$1 15.8,7.07 15.8,9.2 | X_ALIM.P$1 15.54,8.94 | X_ALIM.P$1 15.54,9.54 v16,10

### Text on the board
tNames: CoVAPSy / 2022 / Hat v1.2 / AJ CS